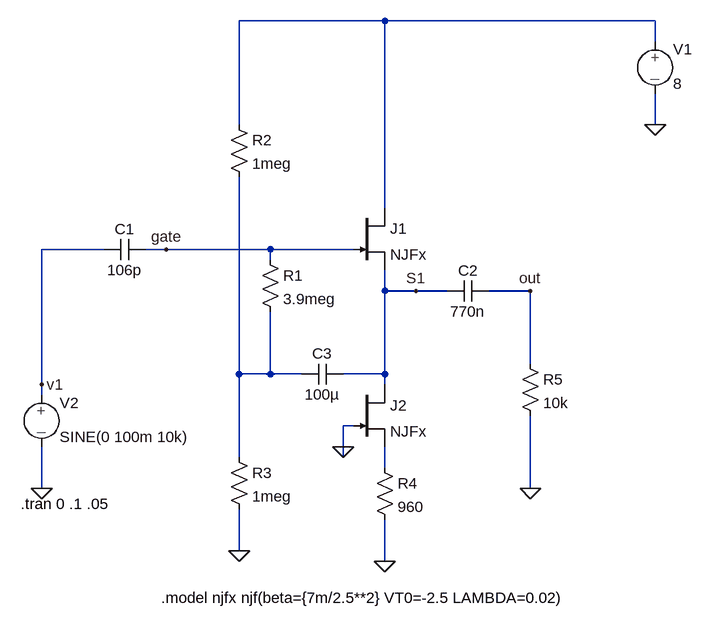
[diagram p0: schematic Klausur_10.2.asc]
Klausur_10.2.asc, the LTspice schematic file:
Version 4
SHEET 1 880 728
WIRE 16 -176 -208 -176
WIRE 432 -176 16 -176
WIRE 432 -144 432 -176
WIRE -208 -16 -208 -176
WIRE 432 -16 432 -64
WIRE 16 112 16 -176
WIRE -416 176 -512 176
WIRE -320 176 -352 176
WIRE -160 176 -320 176
WIRE -32 176 -160 176
WIRE -160 192 -160 176
WIRE 16 240 16 208
WIRE 64 240 16 240
WIRE 112 240 64 240
WIRE 240 240 176 240
WIRE 240 352 240 240
WIRE -208 368 -208 64
WIRE -160 368 -160 272
WIRE -160 368 -208 368
WIRE -112 368 -160 368
WIRE 16 368 16 240
WIRE 16 368 -48 368
WIRE -512 384 -512 176
WIRE 16 384 16 368
WIRE -512 400 -512 384
WIRE -32 448 -48 448
WIRE -48 480 -48 448
WIRE -208 496 -208 368
WIRE -48 496 -48 480
WIRE 16 512 16 480
WIRE -512 544 -512 480
WIRE 240 544 240 432
WIRE -208 640 -208 576
WIRE 16 656 16 592
FLAG -512 544 0
FLAG -208 640 0
FLAG 16 656 0
FLAG 240 544 0
FLAG 432 -16 0
FLAG 240 240 out
FLAG -320 176 gate
FLAG -512 384 v1
FLAG 64 240 S1
FLAG -48 480 0
SYMBOL EIT_Semiconductors\\njf -32 112 R0
SYMATTR InstName J1
SYMATTR Value NJFx
SYMBOL res 224 336 R0
SYMATTR InstName R5
SYMATTR Value 10k
SYMBOL cap -416 192 R270
WINDOW 0 32 32 VTop 0
WINDOW 3 0 32 VBottom 0
SYMATTR InstName C1
SYMATTR Value 106p
SYMBOL cap 112 256 R270
WINDOW 0 32 32 VTop 0
WINDOW 3 0 32 VBottom 0
SYMATTR InstName C2
SYMATTR Value 770n
SYMBOL source-V 432 -160 R0
WINDOW 123 0 0 Left 0
WINDOW 39 0 0 Left 0
SYMATTR InstName V1
SYMATTR Value 8
SYMBOL source-V -512 384 R0
WINDOW 123 0 0 Left 0
WINDOW 39 0 0 Left 0
SYMATTR InstName V2
SYMATTR Value SINE(0 100m 10k)
SYMBOL EIT_Semiconductors\\njf -32 384 R0
SYMATTR InstName J2
SYMATTR Value NJFx
SYMBOL res -224 -32 R0
SYMATTR InstName R2
SYMATTR Value 1meg
SYMBOL res -176 176 R0
SYMATTR InstName R1
SYMATTR Value 3.9meg
SYMBOL res 0 496 R0
SYMATTR InstName R4
SYMATTR Value 960
SYMBOL res -224 480 R0
SYMATTR InstName R3
SYMATTR Value 1meg
SYMBOL cap -48 352 R90
WINDOW 0 0 32 VBottom 0
WINDOW 3 32 32 VTop 0
SYMATTR InstName C3
SYMATTR Value 100µ
TEXT -544 568 Left 0 !.tran 0 .1 .05
TEXT -328 712 Left 0 !.model njfx njf(beta={7m/2.5**2} VT0=-2.5 LAMBDA=0.02)

The netlist it stands for:
* Klausur_10.2.asc
J1 N001 gate S1 NJFx
R5 out 0 10k
C1 v1 gate 106p
C2 S1 out 770n
V1 N001 0 8
V2 v1 0 SINE(0 100m 10k)
J2 S1 0 N003 NJFx
R2 N001 N002 1meg
R1 gate N002 3.9meg
R4 N003 0 960
R3 N002 0 1meg
C3 S1 N002 100µ
.model NJF NJF
.model PJF PJF
.lib standard.jft
.tran 0 .1 .05
.model njfx njf(beta={7m/2.5**2} VT0=-2.5 LAMBDA=0.02)
.backanno
.end